# Altium schematic sheet MX.SchDoc
size A4
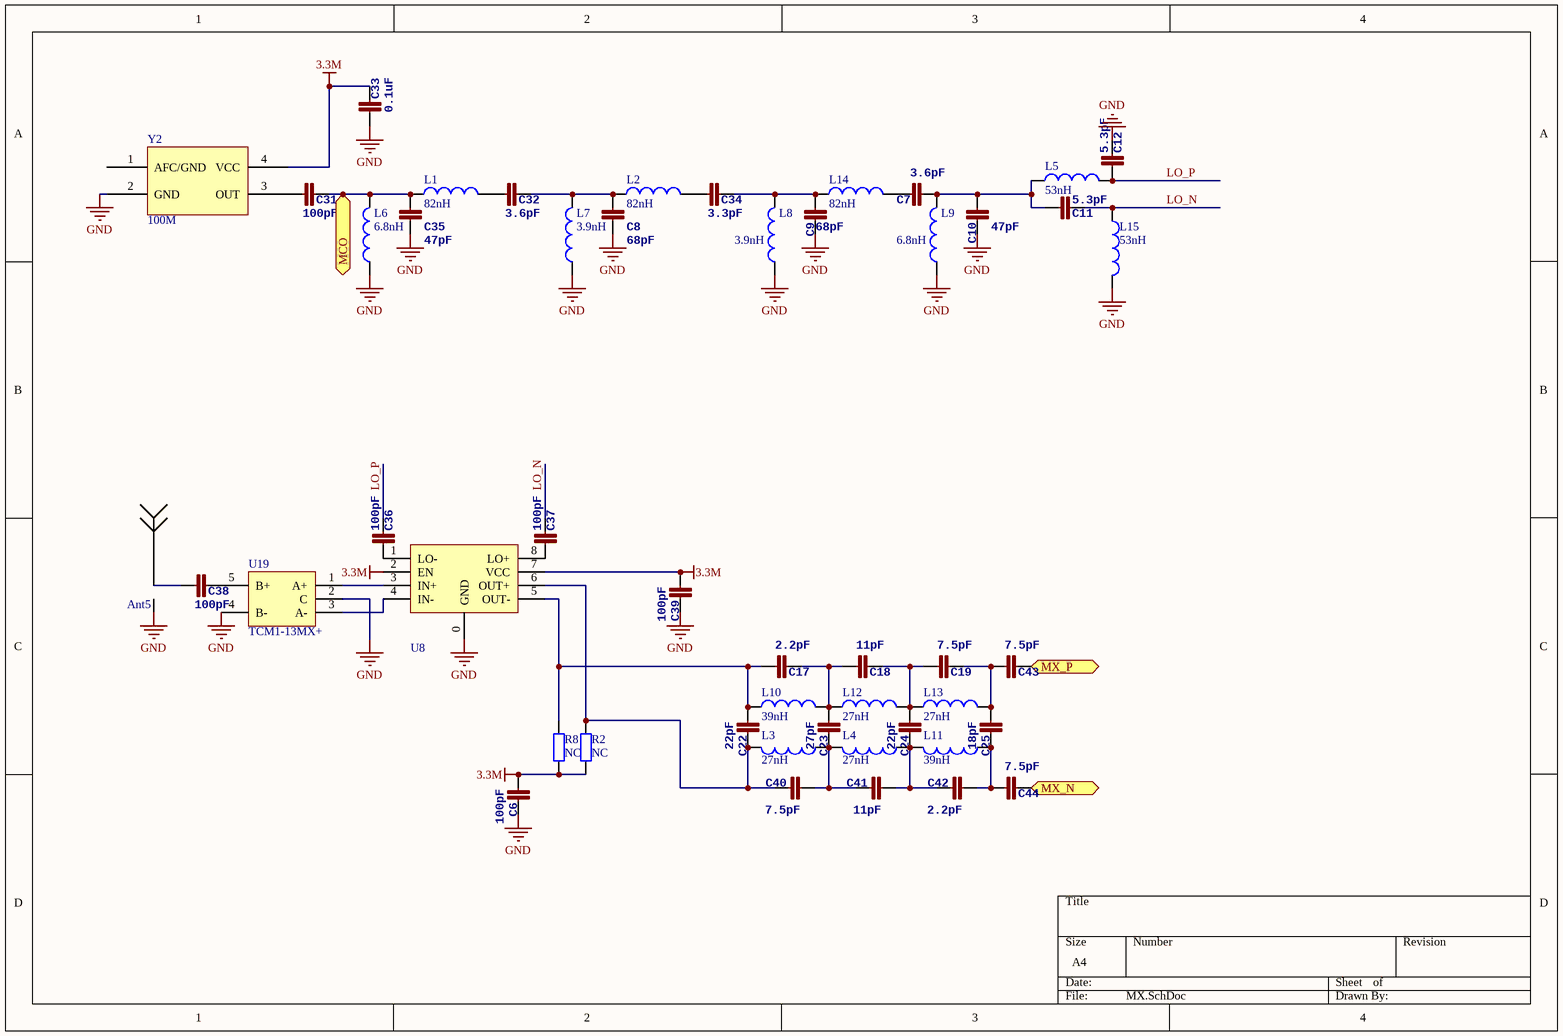
[diagram p0: MX.SchDoc]

## Parts
Ant5  Antenna  [SMA]  (value not drawn)
C6  100pF  [0402]
C7  3.6pF  [0402]
C8  68pF  [0402]
C9  68pF  [0402]
C10  47pF  [0402]
C11  5.3pF  [0402]
C12  5.3pF  [0402]
C17  2.2pF  [0402]
C18  11pF  [0402]
C19  7.5pF  [0402]
C22  22pF  [0402]
C23  27pF  [0402]
C24  22pF  [0402]
C25  18pF  [0402]
C31  100pF  [0402]
C32  3.6pF  [0402]
C33  0.1uF  [0402]
C34  3.3pF  [0402]
C35  47pF  [0402]
C36  100pF  [0402]
C37  100pF  [0402]
C38  100pF  [0402]
C39  100pF  [0402]
C40  7.5pF  [0402]
C41  11pF  [0402]
C42  2.2pF  [0402]
C43  7.5pF  [0402]
C44  7.5pF  [0402]
L1  value 82nH  [0402]  (hidden comment: Inductor)
L2  value 82nH  [0402]  (hidden comment: Inductor)
L3  value 27nH  [0402]  (hidden comment: Inductor)
L4  value 27nH  [0402]  (hidden comment: Inductor)
L5  value 53nH  [0402]  (hidden comment: Inductor)
L6  value 6.8nH  [0402]  (hidden comment: Inductor)
L7  value 3.9nH  [0402]  (hidden comment: Inductor)
L8  value 3.9nH  [0402]  (hidden comment: Inductor)
L9  value 6.8nH  [0402]  (hidden comment: Inductor)
L10  value 39nH  [0402]  (hidden comment: Inductor)
L11  value 39nH  [0402]  (hidden comment: Inductor)
L12  value 27nH  [0402]  (hidden comment: Inductor)
L13  value 27nH  [0402]  (hidden comment: Inductor)
L14  value 82nH  [0402]  (hidden comment: Inductor)
L15  value 53nH  [0402]  (hidden comment: Inductor)
R2  NC  [0402]
R8  NC  [0402]
U8  LT5560  [LT5560]  (value not drawn)
U19  TCM1-13MX+  [TCM-13M+]
Y2  100M  [TXC_7Q]

## Ports
MCO, MX_N, MX_P

## Nets
3.3M: C6.1 C33.2 C39.1 R2.2 R8.2 U8.2(EN) U8.7(VCC) Y2.4(VCC)
GND: Ant5.GND(G) C6.2 C8.2 C9.2 C10.2 C12.2 C33.1 C35.2 C39.2 L6.1 L7.1 L8.1 L9.1 L15.2 U8.0(GND) U19.2(C) U19.4(B-) Y2.2(GND)
LO_N: C11.2 C37.2 L15.1
LO_P: C12.1 C36.2 L5.2
MCO: C31.2 C35.1 L1.1 L6.2 ; port MCO
MX_N: C44.2 ; port MX_N
MX_P: C43.2 ; port MX_P
NetAnt5_1: Ant5.1 C38.1
NetC7_1: C7.1 L14.2
NetC7_2: C7.2 C10.1 C11.1 L5.1 L9.2
NetC8_1: C8.1 C32.2 L2.1 L7.2
NetC9_1: C9.1 C34.2 L8.2 L14.1
NetC17_1: C17.1 C22.1 L10.1 R8.1 U8.5(OUT-)
NetC17_2: C17.2 C18.1 C23.1 L10.2 L12.1
NetC18_2: C18.2 C19.1 C24.1 L12.2 L13.1
NetC19_2: C19.2 C25.1 C43.1 L13.2
NetC22_2: C22.2 C40.2 L3.2 R2.1 U8.6(OUT+)
NetC23_2: C23.2 C40.1 C41.2 L3.1 L4.2
NetC24_2: C24.2 C41.1 C42.2 L4.1 L11.2
NetC25_2: C25.2 C42.1 C44.1 L11.1
NetC31_1: C31.1 Y2.3(OUT)
NetC32_1: C32.1 L1.2
NetC34_1: C34.1 L2.2
NetC36_1: C36.1 U8.1(LO-)
NetC37_1: C37.1 U8.8(LO+)
NetC38_2: C38.2 U19.5(B+)
NetU8_3: U8.3(IN+) U19.1(A+)
NetU8_4: U8.4(IN-) U19.3(A-)

Not connected (* = marked no-connect by the designer): Y2 1(AFC/GND)

## Library data of the parts
C6-C12 C17-C19 C22-C25 C31-C44 = CAP0402-CAP: <b>Capacitor</b> / Standard 0603 ceramic capacitor, and 0.1" leaded capacitor.; PARTNO: CC0402ZRY5V7BB104
L1-L15 = Inductor: Code_IEC: 1005; Published: 8-Jun-2000; LatestRevisionDate: 29-May-2009; LatestRevisionNote: IPC-7351 Footprint Added.; PackageReference: 0402-A; Publisher: Altium Limited; PackageDescription: Chip Inductor; Code_JEITA: 0402
R2 R8 = Res2: Resistor; Published: 8-Jun-2000; LatestRevisionDate: 17-Jul-2002; LatestRevisionNote: Re-released for DXP Platform.; PackageReference: AXIAL-0.4; Publisher: Altium Limited; PackageDescription: Axial Device, Thru-Hole; 2 Leads; 0.4 in Pin Spacing
U19 = TCM-63AX+
Y2 = OSC_40M